# Altium schematic sheet AIM2 - Top Sheet REVB.SchDoc: Top Sheet
size B; DrawnBy: DJW; DocumentNumber: 1; SheetNumber: 1; SheetTotal: 12
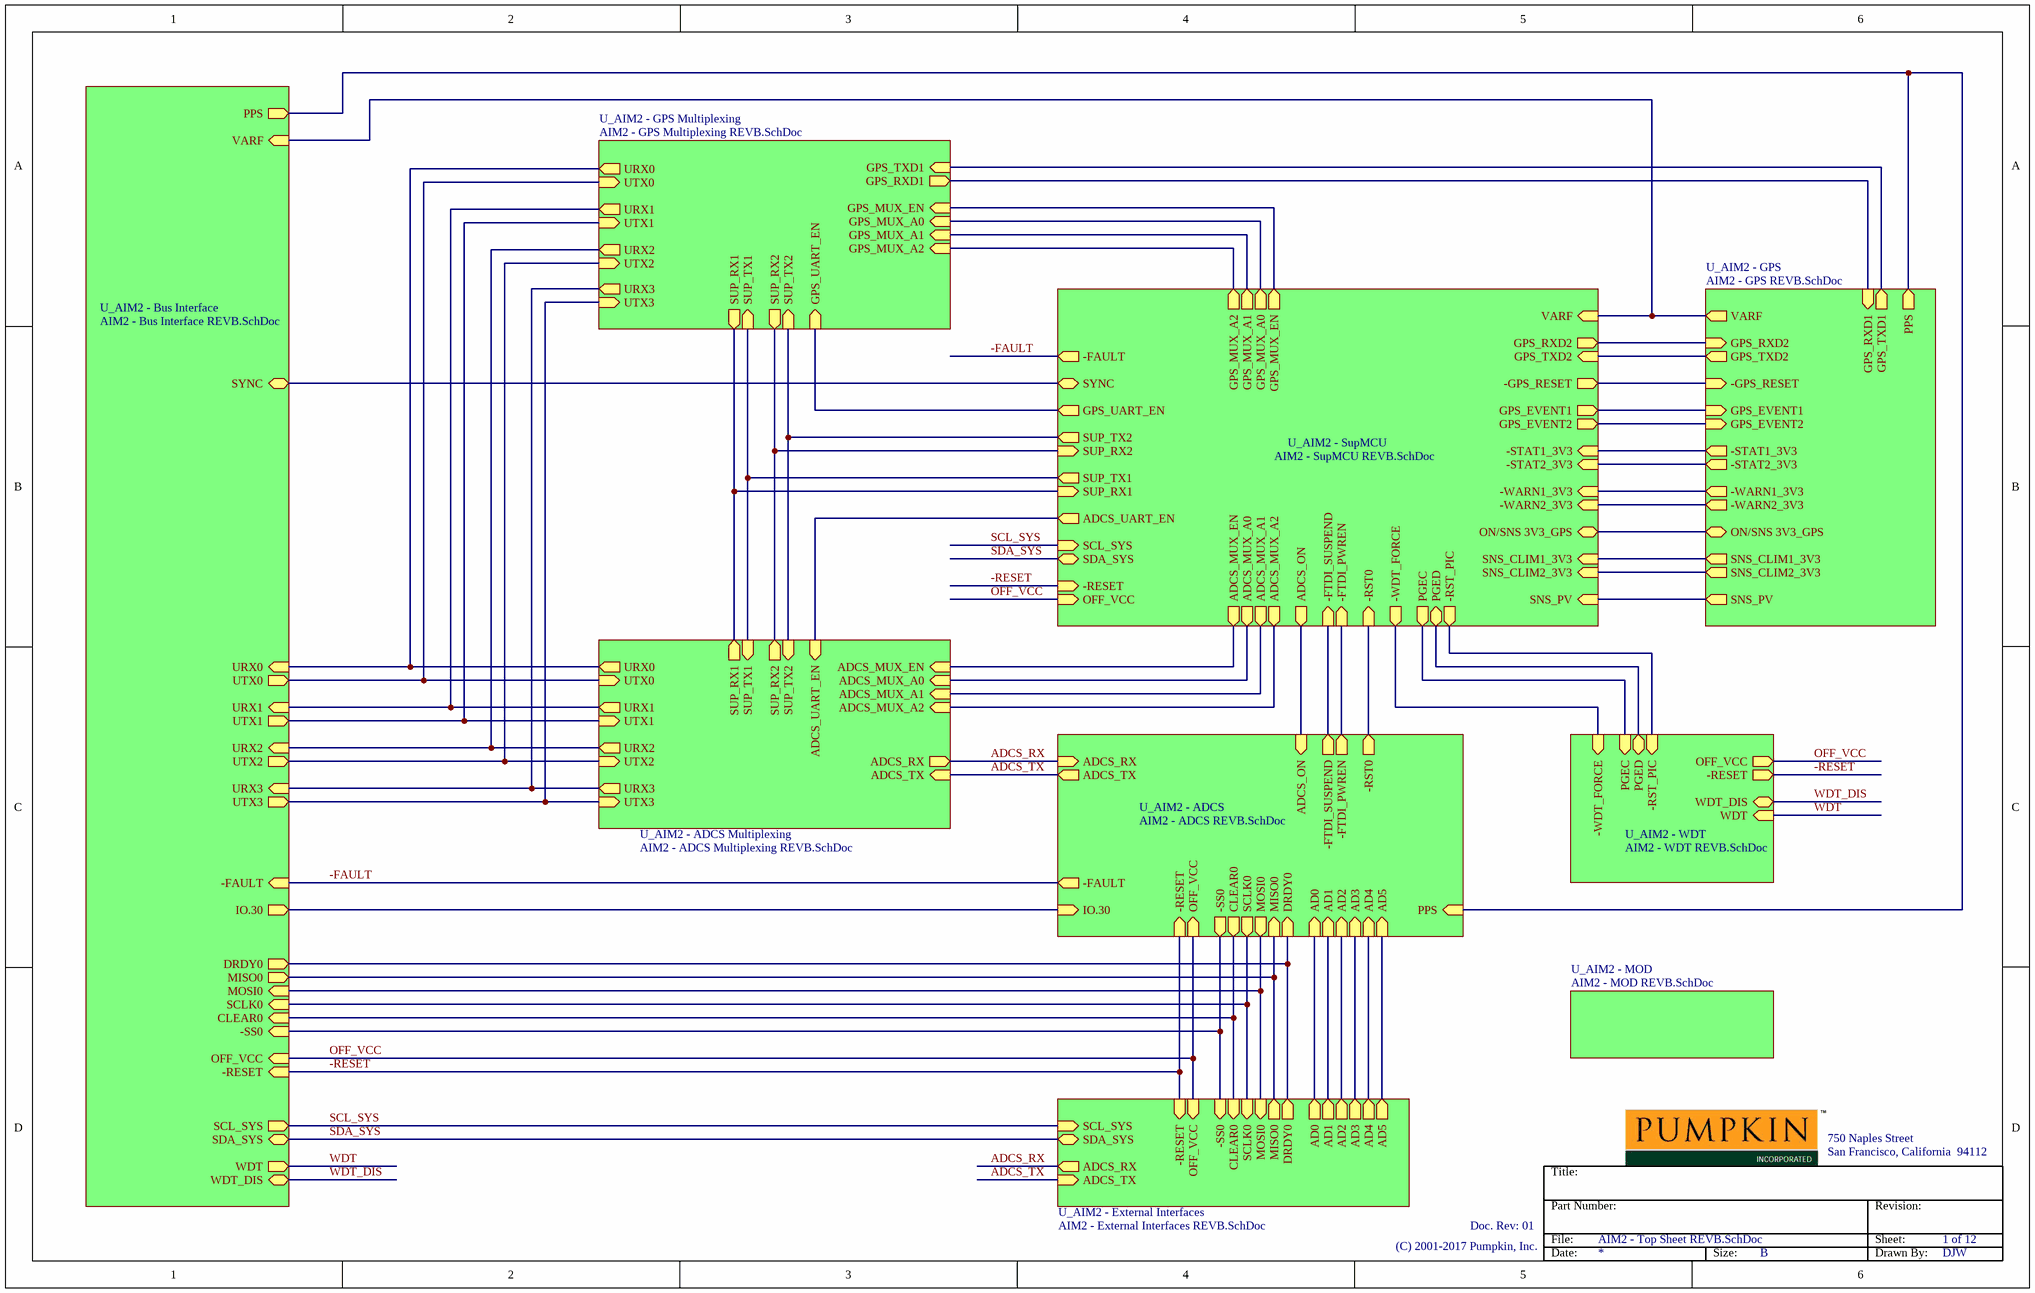
[diagram p0: AIM2 - Top Sheet REVB.SchDoc]

## Sub-sheets
U_AIM2 - ADCS = AIM2 - ADCS REVB.SchDoc: DRDY0 (in), -RST0 (out), MISO0 (in), PPS (in), CLEAR0 (out), SCLK0 (out), MOSI0 (out), -SS0 (out), -RESET (in), OFF_VCC (in), ADCS_RX (in), ADCS_TX (out), ADCS_ON (in), IO.30 (in), -FAULT (out), -FTDI_PWREN (out), -FTDI_SUSPEND (out), AD5 (in), AD4 (in), AD3 (in), AD2 (in), AD1 (in), AD0 (in)
U_AIM2 - ADCS Multiplexing = AIM2 - ADCS Multiplexing REVB.SchDoc: UTX0 (in), URX1 (out), URX0 (out), UTX1 (in), UTX2 (in), URX2 (out), URX3 (out), UTX3 (in), SUP_RX1 (out), SUP_TX1 (in), SUP_RX2 (out), ADCS_RX (out), ADCS_TX (in), SUP_TX2 (in), ADCS_MUX_EN (in), ADCS_MUX_A0 (in), ADCS_MUX_A1 (in), ADCS_MUX_A2 (in), ADCS_UART_EN (in)
U_AIM2 - Bus Interface = AIM2 - Bus Interface REVB.SchDoc: URX0 (in), URX1 (in), URX2 (in), -RESET (in), OFF_VCC (in), SDA_SYS (bidir), SCL_SYS (out), SYNC (bidir), -FAULT (in), UTX2 (out), UTX1 (out), UTX0 (out), UTX3 (out), URX3 (in), WDT (out), IO.30 (out), MISO0 (out), PPS (out), DRDY0 (out), MOSI0 (in), -SS0 (in), SCLK0 (in), CLEAR0 (in), VARF (in), WDT_DIS (bidir)
U_AIM2 - External Interfaces = AIM2 - External Interfaces REVB.SchDoc: ADCS_RX (out), AD5 (out), -RESET (in), OFF_VCC (in), SCL_SYS (in), SDA_SYS (bidir), CLEAR0 (in), SCLK0 (in), -SS0 (in), MOSI0 (in), AD4 (out), AD3 (out), AD2 (out), AD1 (out), AD0 (out), ADCS_TX (in), MISO0 (out), DRDY0 (out)
U_AIM2 - GPS = AIM2 - GPS REVB.SchDoc: GPS_TXD1 (out), GPS_TXD2 (out), SNS_PV (out), VARF (out), PPS (out), -GPS_RESET (in), GPS_RXD1 (in), GPS_RXD2 (in), GPS_EVENT1 (in), GPS_EVENT2 (in), -STAT1_3V3 (out), -STAT2_3V3 (out), -WARN1_3V3 (out), -WARN2_3V3 (out), ON/SNS 3V3_GPS (bidir), SNS_CLIM2_3V3 (out), SNS_CLIM1_3V3 (out)
U_AIM2 - GPS Multiplexing = AIM2 - GPS Multiplexing REVB.SchDoc: UTX0 (in), URX1 (out), URX0 (out), UTX1 (in), UTX2 (in), URX2 (out), URX3 (out), UTX3 (in), SUP_RX1 (out), SUP_TX1 (in), GPS_RXD1 (out), GPS_TXD1 (in), GPS_MUX_EN (in), GPS_MUX_A0 (in), GPS_MUX_A1 (in), GPS_MUX_A2 (in), GPS_UART_EN (in), SUP_TX2 (in), SUP_RX2 (out)
U_AIM2 - MOD = AIM2 - MOD REVB.SchDoc: no entries
U_AIM2 - SupMCU = AIM2 - SupMCU REVB.SchDoc: GPS_RXD2 (out), GPS_TXD2 (in), -GPS_RESET (out), GPS_EVENT1 (out), GPS_EVENT2 (out), -STAT1_3V3 (in), -STAT2_3V3 (in), -WARN1_3V3 (in), -WARN2_3V3 (in), ON/SNS 3V3_GPS (bidir), SNS_CLIM1_3V3 (in), SNS_CLIM2_3V3 (in), SNS_PV (in), VARF (in), -RST0 (in), -FTDI_PWREN (in), -FTDI_SUSPEND (in), ADCS_ON (out), ADCS_MUX_A2 (out), ADCS_MUX_A1 (out), ADCS_MUX_A0 (out), ADCS_MUX_EN (out), GPS_MUX_EN (out), GPS_MUX_A0 (out), GPS_MUX_A1 (out), GPS_MUX_A2 (out), GPS_UART_EN (out), ADCS_UART_EN (out), SUP_TX2 (out), SUP_RX2 (in), SUP_TX1 (out), SUP_RX1 (in), -WDT_FORCE (out), PGEC (out), PGED (bidir), -RST_PIC (out), SYNC (bidir), SCL_SYS (in), SDA_SYS (bidir), OFF_VCC (in), -FAULT (out), -RESET (in)
U_AIM2 - WDT = AIM2 - WDT REVB.SchDoc: WDT (in), OFF_VCC (out), -RESET (out), -WDT_FORCE (in), PGEC (in), -RST_PIC (in), PGED (bidir), WDT_DIS (bidir)

## Nets
-FAULT: sheet U_AIM2 - ADCS/-FAULT, sheet U_AIM2 - Bus Interface/-FAULT, sheet U_AIM2 - SupMCU/-FAULT
-RESET: sheet U_AIM2 - WDT/-RESET, sheet U_AIM2 - ADCS/-RESET, sheet U_AIM2 - Bus Interface/-RESET, sheet U_AIM2 - External Interfaces/-RESET, sheet U_AIM2 - SupMCU/-RESET
ADCS_RX: sheet U_AIM2 - ADCS/ADCS_RX, sheet U_AIM2 - ADCS Multiplexing/ADCS_RX, sheet U_AIM2 - External Interfaces/ADCS_RX
ADCS_TX: sheet U_AIM2 - ADCS/ADCS_TX, sheet U_AIM2 - ADCS Multiplexing/ADCS_TX, sheet U_AIM2 - External Interfaces/ADCS_TX
OFF_VCC: sheet U_AIM2 - WDT/OFF_VCC, sheet U_AIM2 - ADCS/OFF_VCC, sheet U_AIM2 - Bus Interface/OFF_VCC, sheet U_AIM2 - External Interfaces/OFF_VCC, sheet U_AIM2 - SupMCU/OFF_VCC
SCL_SYS: sheet U_AIM2 - Bus Interface/SCL_SYS, sheet U_AIM2 - External Interfaces/SCL_SYS, sheet U_AIM2 - SupMCU/SCL_SYS
SDA_SYS: sheet U_AIM2 - Bus Interface/SDA_SYS, sheet U_AIM2 - External Interfaces/SDA_SYS, sheet U_AIM2 - SupMCU/SDA_SYS
WDT: sheet U_AIM2 - WDT/WDT, sheet U_AIM2 - Bus Interface/WDT
WDT_DIS: sheet U_AIM2 - WDT/WDT_DIS, sheet U_AIM2 - Bus Interface/WDT_DIS
(unnamed): sheet U_AIM2 - WDT/-WDT_FORCE, sheet U_AIM2 - SupMCU/-WDT_FORCE
(unnamed): sheet U_AIM2 - WDT/PGEC, sheet U_AIM2 - SupMCU/PGEC
(unnamed): sheet U_AIM2 - WDT/-RST_PIC, sheet U_AIM2 - SupMCU/-RST_PIC
(unnamed): sheet U_AIM2 - WDT/PGED, sheet U_AIM2 - SupMCU/PGED
(unnamed): sheet U_AIM2 - ADCS/DRDY0, sheet U_AIM2 - Bus Interface/DRDY0, sheet U_AIM2 - External Interfaces/DRDY0
(unnamed): sheet U_AIM2 - ADCS/-RST0, sheet U_AIM2 - SupMCU/-RST0
(unnamed): sheet U_AIM2 - ADCS/MISO0, sheet U_AIM2 - Bus Interface/MISO0, sheet U_AIM2 - External Interfaces/MISO0
(unnamed): sheet U_AIM2 - ADCS/PPS, sheet U_AIM2 - Bus Interface/PPS, sheet U_AIM2 - GPS/PPS
(unnamed): sheet U_AIM2 - ADCS/CLEAR0, sheet U_AIM2 - Bus Interface/CLEAR0, sheet U_AIM2 - External Interfaces/CLEAR0
(unnamed): sheet U_AIM2 - ADCS/SCLK0, sheet U_AIM2 - Bus Interface/SCLK0, sheet U_AIM2 - External Interfaces/SCLK0
(unnamed): sheet U_AIM2 - ADCS/MOSI0, sheet U_AIM2 - Bus Interface/MOSI0, sheet U_AIM2 - External Interfaces/MOSI0
(unnamed): sheet U_AIM2 - ADCS/-SS0, sheet U_AIM2 - Bus Interface/-SS0, sheet U_AIM2 - External Interfaces/-SS0
(unnamed): sheet U_AIM2 - ADCS/ADCS_ON, sheet U_AIM2 - SupMCU/ADCS_ON
(unnamed): sheet U_AIM2 - ADCS/IO.30, sheet U_AIM2 - Bus Interface/IO.30
(unnamed): sheet U_AIM2 - ADCS/-FTDI_PWREN, sheet U_AIM2 - SupMCU/-FTDI_PWREN
(unnamed): sheet U_AIM2 - ADCS/-FTDI_SUSPEND, sheet U_AIM2 - SupMCU/-FTDI_SUSPEND
(unnamed): sheet U_AIM2 - ADCS/AD5, sheet U_AIM2 - External Interfaces/AD5
(unnamed): sheet U_AIM2 - ADCS/AD4, sheet U_AIM2 - External Interfaces/AD4
(unnamed): sheet U_AIM2 - ADCS/AD3, sheet U_AIM2 - External Interfaces/AD3
(unnamed): sheet U_AIM2 - ADCS/AD2, sheet U_AIM2 - External Interfaces/AD2
(unnamed): sheet U_AIM2 - ADCS/AD1, sheet U_AIM2 - External Interfaces/AD1
(unnamed): sheet U_AIM2 - ADCS/AD0, sheet U_AIM2 - External Interfaces/AD0
(unnamed): sheet U_AIM2 - ADCS Multiplexing/UTX0, sheet U_AIM2 - Bus Interface/UTX0, sheet U_AIM2 - GPS Multiplexing/UTX0
(unnamed): sheet U_AIM2 - ADCS Multiplexing/URX1, sheet U_AIM2 - Bus Interface/URX1, sheet U_AIM2 - GPS Multiplexing/URX1
(unnamed): sheet U_AIM2 - ADCS Multiplexing/URX0, sheet U_AIM2 - Bus Interface/URX0, sheet U_AIM2 - GPS Multiplexing/URX0
(unnamed): sheet U_AIM2 - ADCS Multiplexing/UTX1, sheet U_AIM2 - Bus Interface/UTX1, sheet U_AIM2 - GPS Multiplexing/UTX1
(unnamed): sheet U_AIM2 - ADCS Multiplexing/UTX2, sheet U_AIM2 - Bus Interface/UTX2, sheet U_AIM2 - GPS Multiplexing/UTX2
(unnamed): sheet U_AIM2 - ADCS Multiplexing/URX2, sheet U_AIM2 - Bus Interface/URX2, sheet U_AIM2 - GPS Multiplexing/URX2
(unnamed): sheet U_AIM2 - ADCS Multiplexing/URX3, sheet U_AIM2 - Bus Interface/URX3, sheet U_AIM2 - GPS Multiplexing/URX3
(unnamed): sheet U_AIM2 - ADCS Multiplexing/UTX3, sheet U_AIM2 - Bus Interface/UTX3, sheet U_AIM2 - GPS Multiplexing/UTX3
(unnamed): sheet U_AIM2 - ADCS Multiplexing/SUP_RX1, sheet U_AIM2 - GPS Multiplexing/SUP_RX1, sheet U_AIM2 - SupMCU/SUP_RX1
(unnamed): sheet U_AIM2 - ADCS Multiplexing/SUP_TX1, sheet U_AIM2 - GPS Multiplexing/SUP_TX1, sheet U_AIM2 - SupMCU/SUP_TX1
(unnamed): sheet U_AIM2 - ADCS Multiplexing/SUP_RX2, sheet U_AIM2 - GPS Multiplexing/SUP_RX2, sheet U_AIM2 - SupMCU/SUP_RX2
(unnamed): sheet U_AIM2 - ADCS Multiplexing/SUP_TX2, sheet U_AIM2 - GPS Multiplexing/SUP_TX2, sheet U_AIM2 - SupMCU/SUP_TX2
(unnamed): sheet U_AIM2 - ADCS Multiplexing/ADCS_MUX_EN, sheet U_AIM2 - SupMCU/ADCS_MUX_EN
(unnamed): sheet U_AIM2 - ADCS Multiplexing/ADCS_MUX_A0, sheet U_AIM2 - SupMCU/ADCS_MUX_A0
(unnamed): sheet U_AIM2 - ADCS Multiplexing/ADCS_MUX_A1, sheet U_AIM2 - SupMCU/ADCS_MUX_A1
(unnamed): sheet U_AIM2 - ADCS Multiplexing/ADCS_MUX_A2, sheet U_AIM2 - SupMCU/ADCS_MUX_A2
(unnamed): sheet U_AIM2 - ADCS Multiplexing/ADCS_UART_EN, sheet U_AIM2 - SupMCU/ADCS_UART_EN
(unnamed): sheet U_AIM2 - Bus Interface/SYNC, sheet U_AIM2 - SupMCU/SYNC
(unnamed): sheet U_AIM2 - Bus Interface/VARF, sheet U_AIM2 - GPS/VARF, sheet U_AIM2 - SupMCU/VARF
(unnamed): sheet U_AIM2 - GPS/GPS_TXD1, sheet U_AIM2 - GPS Multiplexing/GPS_TXD1
(unnamed): sheet U_AIM2 - GPS/GPS_TXD2, sheet U_AIM2 - SupMCU/GPS_TXD2
(unnamed): sheet U_AIM2 - GPS/SNS_PV, sheet U_AIM2 - SupMCU/SNS_PV
(unnamed): sheet U_AIM2 - GPS/-GPS_RESET, sheet U_AIM2 - SupMCU/-GPS_RESET
(unnamed): sheet U_AIM2 - GPS/GPS_RXD1, sheet U_AIM2 - GPS Multiplexing/GPS_RXD1
(unnamed): sheet U_AIM2 - GPS/GPS_RXD2, sheet U_AIM2 - SupMCU/GPS_RXD2
(unnamed): sheet U_AIM2 - GPS/GPS_EVENT1, sheet U_AIM2 - SupMCU/GPS_EVENT1
(unnamed): sheet U_AIM2 - GPS/GPS_EVENT2, sheet U_AIM2 - SupMCU/GPS_EVENT2
(unnamed): sheet U_AIM2 - GPS/-STAT1_3V3, sheet U_AIM2 - SupMCU/-STAT1_3V3
(unnamed): sheet U_AIM2 - GPS/-STAT2_3V3, sheet U_AIM2 - SupMCU/-STAT2_3V3
(unnamed): sheet U_AIM2 - GPS/-WARN1_3V3, sheet U_AIM2 - SupMCU/-WARN1_3V3
(unnamed): sheet U_AIM2 - GPS/-WARN2_3V3, sheet U_AIM2 - SupMCU/-WARN2_3V3
(unnamed): sheet U_AIM2 - GPS/ON/SNS 3V3_GPS, sheet U_AIM2 - SupMCU/ON/SNS 3V3_GPS
(unnamed): sheet U_AIM2 - GPS/SNS_CLIM2_3V3, sheet U_AIM2 - SupMCU/SNS_CLIM2_3V3
(unnamed): sheet U_AIM2 - GPS/SNS_CLIM1_3V3, sheet U_AIM2 - SupMCU/SNS_CLIM1_3V3
(unnamed): sheet U_AIM2 - GPS Multiplexing/GPS_MUX_EN, sheet U_AIM2 - SupMCU/GPS_MUX_EN
(unnamed): sheet U_AIM2 - GPS Multiplexing/GPS_MUX_A0, sheet U_AIM2 - SupMCU/GPS_MUX_A0
(unnamed): sheet U_AIM2 - GPS Multiplexing/GPS_MUX_A1, sheet U_AIM2 - SupMCU/GPS_MUX_A1
(unnamed): sheet U_AIM2 - GPS Multiplexing/GPS_MUX_A2, sheet U_AIM2 - SupMCU/GPS_MUX_A2
(unnamed): sheet U_AIM2 - GPS Multiplexing/GPS_UART_EN, sheet U_AIM2 - SupMCU/GPS_UART_EN

## Notes on the sheet
- Title:
- 750 Naples Street
- San Francisco, California  94112
- Doc. Rev: 01
- File:
- Part Number:
- Revision:
- Sheet:
- (C) 2001-2017 Pumpkin, Inc.
- Date:
- Size:
- B
- Drawn By: